# Altium schematic sheet LPCB220 - DAC A.SchDoc
size A3; Address1: Factory 10; Address2: 9-13 Dingley Avenue, Dandeong, VICTORIA 3175, AUSTRALIA; DocumentNumber: 6; Revision: 1; SheetNumber: 6; SheetTotal: 18; Lockie__PCB_SUB_ASSEMBLY: DAC A; Lockie__PCB_ASSEMBLY: Brake Control; Lockie__LDL: LPCB220; Lockie__PCB_DESCRIPTION: Redundant Stepper Node
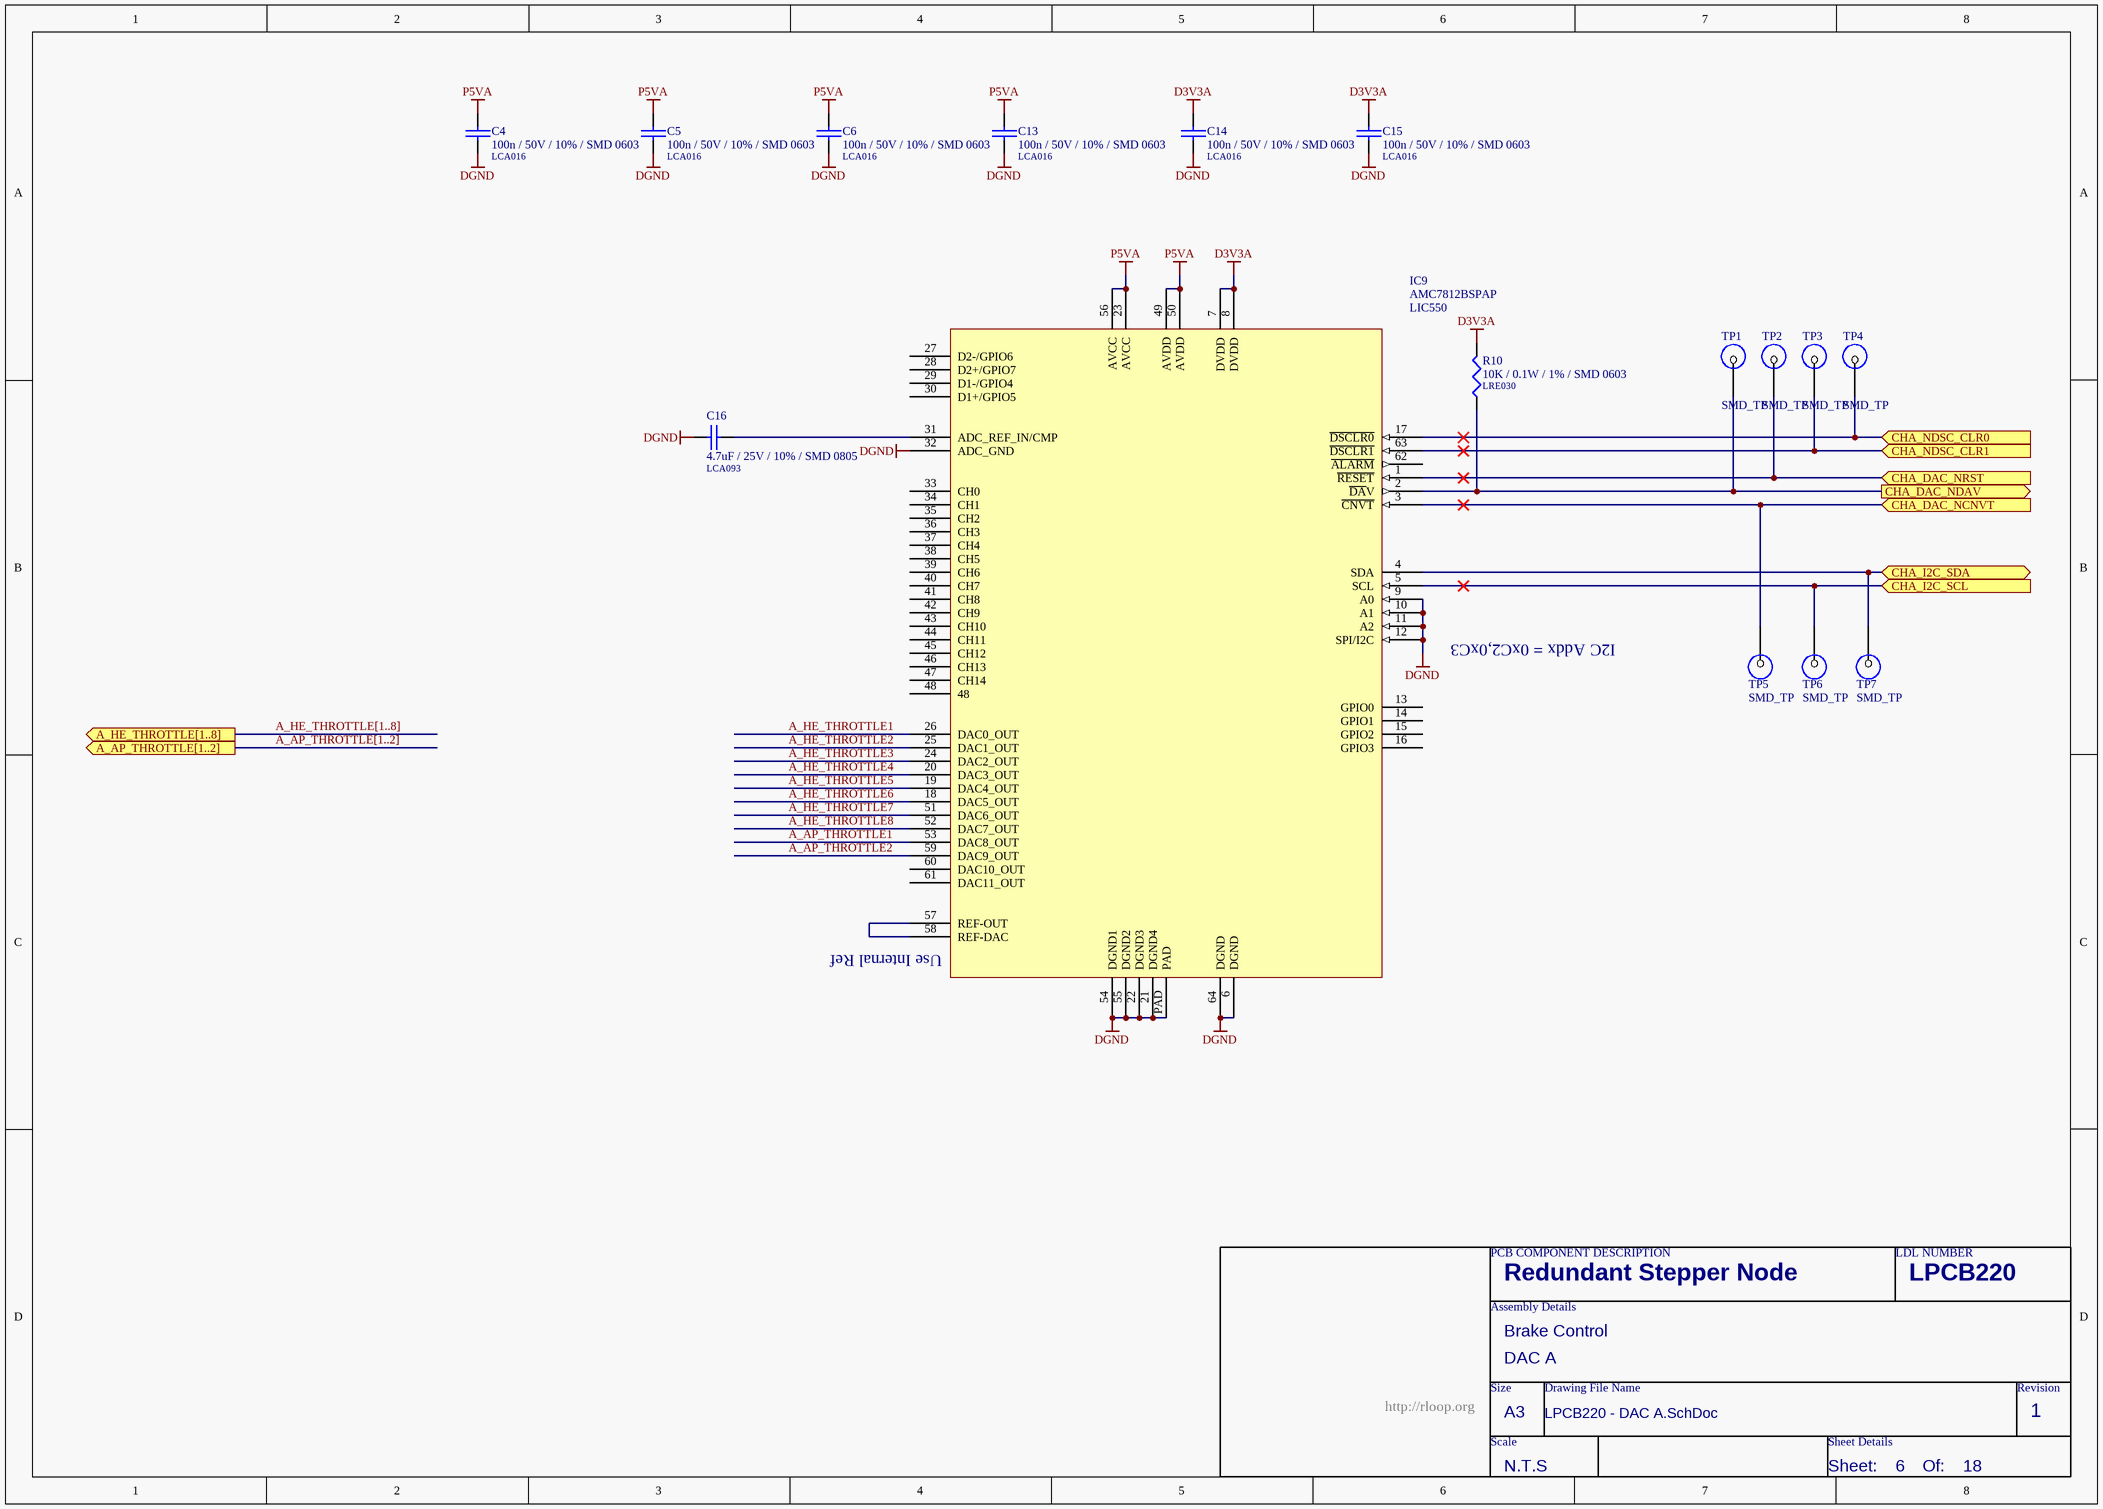
[diagram p0: LPCB220 - DAC A.SchDoc]

## Parts
C4  100n / 50V / 10% / SMD 0603  LDL_NUMBER: LCA016  [LFP011__CC1608-0603-IPC7351_B]
C5  100n / 50V / 10% / SMD 0603  LDL_NUMBER: LCA016  [LFP011__CC1608-0603-IPC7351_B]
C6  100n / 50V / 10% / SMD 0603  LDL_NUMBER: LCA016  [LFP011__CC1608-0603-IPC7351_B]
C13  100n / 50V / 10% / SMD 0603  LDL_NUMBER: LCA016  [LFP011__CC1608-0603-IPC7351_B]
C14  100n / 50V / 10% / SMD 0603  LDL_NUMBER: LCA016  [LFP011__CC1608-0603-IPC7351_B]
C15  100n / 50V / 10% / SMD 0603  LDL_NUMBER: LCA016  [LFP011__CC1608-0603-IPC7351_B]
C16  4.7uF / 25V / 10% / SMD 0805  LDL_NUMBER: LCA093  [LFP010__CC2012-0805-IPC7351_B]
IC9  AMC7812BSPAP  LDL_NUMBER: LIC550  [LFP134__H-QFP10X10-64N]
R10  10K / 0.1W / 1% / SMD 0603  LDL_NUMBER: LRE030  [LFP020__CR1608-0603-IPC7351_B]
TP1  SMD_TP  [SMD-TP]  (no BOM)
TP2  SMD_TP  [SMD-TP]  (no BOM)
TP3  SMD_TP  [SMD-TP]  (no BOM)
TP4  SMD_TP  [SMD-TP]  (no BOM)
TP5  SMD_TP  [SMD-TP]  (no BOM)
TP6  SMD_TP  [SMD-TP]  (no BOM)
TP7  SMD_TP  [SMD-TP]  (no BOM)

## Ports
A_AP_THROTTLE[1..2] (out), A_HE_THROTTLE[1..8] (out), CHA_DAC_NCNVT (in), CHA_DAC_NDAV (out), CHA_DAC_NRST (in), CHA_I2C_SCL (in), CHA_I2C_SDA (bidir), CHA_NDSC_CLR0 (in), CHA_NDSC_CLR1 (in)

## Nets
D3V3A: C14.1 C15.1 IC9.7(DVDD) IC9.8(DVDD) R10.2
DGND: C4.2 C5.2 C6.2 C13.2 C14.2 C15.2 C16.1 IC9.6(DGND) IC9.9(A0) IC9.10(A1) IC9.11(A2) IC9.12(SPI/I2C) IC9.21(DGND4) IC9.22(DGND3) IC9.32(ADC_GND) IC9.54(DGND1) IC9.55(DGND2) IC9.64(DGND) IC9.PAD
P5VA: C4.1 C5.1 C6.1 C13.1 IC9.23(AVCC) IC9.49(AVDD) IC9.50(AVDD) IC9.56(AVCC)
A_AP_THROTTLE1: IC9.53(DAC8_OUT)
A_AP_THROTTLE2: IC9.59(DAC9_OUT)
A_HE_THROTTLE1: IC9.26(DAC0_OUT)
A_HE_THROTTLE2: IC9.25(DAC1_OUT)
A_HE_THROTTLE3: IC9.24(DAC2_OUT)
A_HE_THROTTLE4: IC9.20(DAC3_OUT)
A_HE_THROTTLE5: IC9.19(DAC4_OUT)
A_HE_THROTTLE6: IC9.18(DAC5_OUT)
A_HE_THROTTLE7: IC9.51(DAC6_OUT)
A_HE_THROTTLE8: IC9.52(DAC7_OUT)
CHA_DAC_NCNVT: IC9.3(~{CNVT}) TP5.1 ; port CHA_DAC_NCNVT
CHA_DAC_NDAV: IC9.2(~{DA}V) R10.1 TP1.1 ; port CHA_DAC_NDAV
CHA_DAC_NRST: IC9.1(~{RESET}) TP2.1 ; port CHA_DAC_NRST
CHA_I2C_SCL: IC9.5(SCL) TP6.1 ; port CHA_I2C_SCL
CHA_I2C_SDA: IC9.4(SDA) TP7.1 ; port CHA_I2C_SDA
CHA_NDSC_CLR0: IC9.17(~{DSCLR0}) TP4.1 ; port CHA_NDSC_CLR0
CHA_NDSC_CLR1: IC9.63(~{DSCLR1}) TP3.1 ; port CHA_NDSC_CLR1
NetC16_2: C16.2 IC9.31(ADC_REF_IN/CMP)
NetIC9_57: IC9.57(REF-OUT) IC9.58(REF-DAC)

Not connected (* = marked no-connect by the designer): IC9 13(GPIO0) 14(GPIO1) 15(GPIO2) 16(GPIO3) 27(D2-/GPIO6) 28(D2+/GPIO7) 29(D1-/GPIO4) 30(D1+/GPIO5) 33(CH0) 34(CH1) 35(CH2) 36(CH3) 37(CH4) 38(CH5) 39(CH6) 40(CH7) 41(CH8) 42(CH9) 43(CH10) 44(CH11) 45(CH12) 46(CH13) 47(CH14) 48 60(DAC10_OUT) 61(DAC11_OUT) 62(~{ALARM})

## Buses and harness runs
bus A_AP_THROTTLE[1..2] = port A_AP_THROTTLE[1..2]
bus A_HE_THROTTLE[1..8] = port A_HE_THROTTLE[1..8]

## Notes on the sheet
- I2C Addx = 0xC2,0xC3
- (near IC9) Use Internal Ref
- PCB COMPONENT DESCRIPTION
- LDL NUMBER
- Assembly Details
- Size
- Drawing File Name
- Revision
- http://rloop.org
- Scale
- A3
- Sheet Details
- N.T.S
- Sheet:
- Of:

## Library data of the parts
C4-C6 C13-C15 = 100n / 50V / 10% / SMD 0603: Capacitor, Ceramic Chip, 100nF (0.1uF), 50V, 5%, SMD 0603 [LCA016]; FMEDA__OPERATING__VOLTAGE_MIN: 0; FMEDA__OPERATING__VOLTAGE_MAX: 3.3; FMEDA__OPERATING__TEMP_MIN: -20; FMEDA__OPERATING__TEMP_TYP: 27; FMEDA__OPERATING__TEMP_MAX: 50; FMEDA__CHANNEL: COM; Value: 100n; FMEDA__FUNCTION_IN_SYSTEM: *; FMEDA__OPERATING__VOLTAGE_TYP: 3.3
C16 = 4.7uF / 25V / 10% / SMD 0805: Capacitor, Ceramic Chip, 4.7uF, 25V, 10%, SMD 0805 [LCA093]; Value: 4.7u; FMEDA__OPERATING__TEMP_MAX: 50; FMEDA__OPERATING__TEMP_MIN: -20; FMEDA__OPERATING__TEMP_TYP: 27; FMEDA__OPERATING__VOLTAGE_MAX: 0; FMEDA__CHANNEL: COM; FMEDA__OPERATING__VOLTAGE_MIN: 0; FMEDA__OPERATING__VOLTAGE_TYP: 0; FMEDA__FUNCTION_IN_SYSTEM: *
IC9 = AMC7812BSPAP: IC, ADC / DAC, SMD [LIC550]
R10 = 10K / 0.1W / 1% / SMD 0603: Resistor, Ceramic Chip, 10K, 0.1W, 1%, SMD 0603 [LRE030]; FMEDA__OPERATING__POWER_MAX: 0; FMEDA__OPERATING__TEMP_MAX: 50; FMEDA__OPERATING__TEMP_MIN: -20; FMEDA__OPERATING__TEMP_TYP: 27; FMEDA__CHANNEL: COM; Value: 10K; FMEDA__OPERATING__POWER_MIN: 0; FMEDA__OPERATING__VOLTAGE_MAX: 0; FMEDA__OPERATING__VOLTAGE_MIN: 0; FMEDA__OPERATING__VOLTAGE_TYP: 0; FMEDA__FUNCTION_IN_SYSTEM: *
TP1-TP7 = SMD_TP: SMD Test Point; FMEDA__CHANNEL: COM; FMEDA__OPERATING__CURRENT_MAX: 0; FMEDA__OPERATING__TEMP_MAX: 50; FMEDA__OPERATING__TEMP_MIN: -20; FMEDA__OPERATING__TEMP_TYP: 27; FMEDA__OPERATING__VOLTAGE_MAX: 16; FMEDA__OPERATING__VOLTAGE_TYP: 12; FMEDA__OPERATING__CURRENT_MIN: 0; FMEDA__OPERATING__CURRENT_TYP: 0; FMEDA__OPERATING__VOLTAGE_MIN: 0